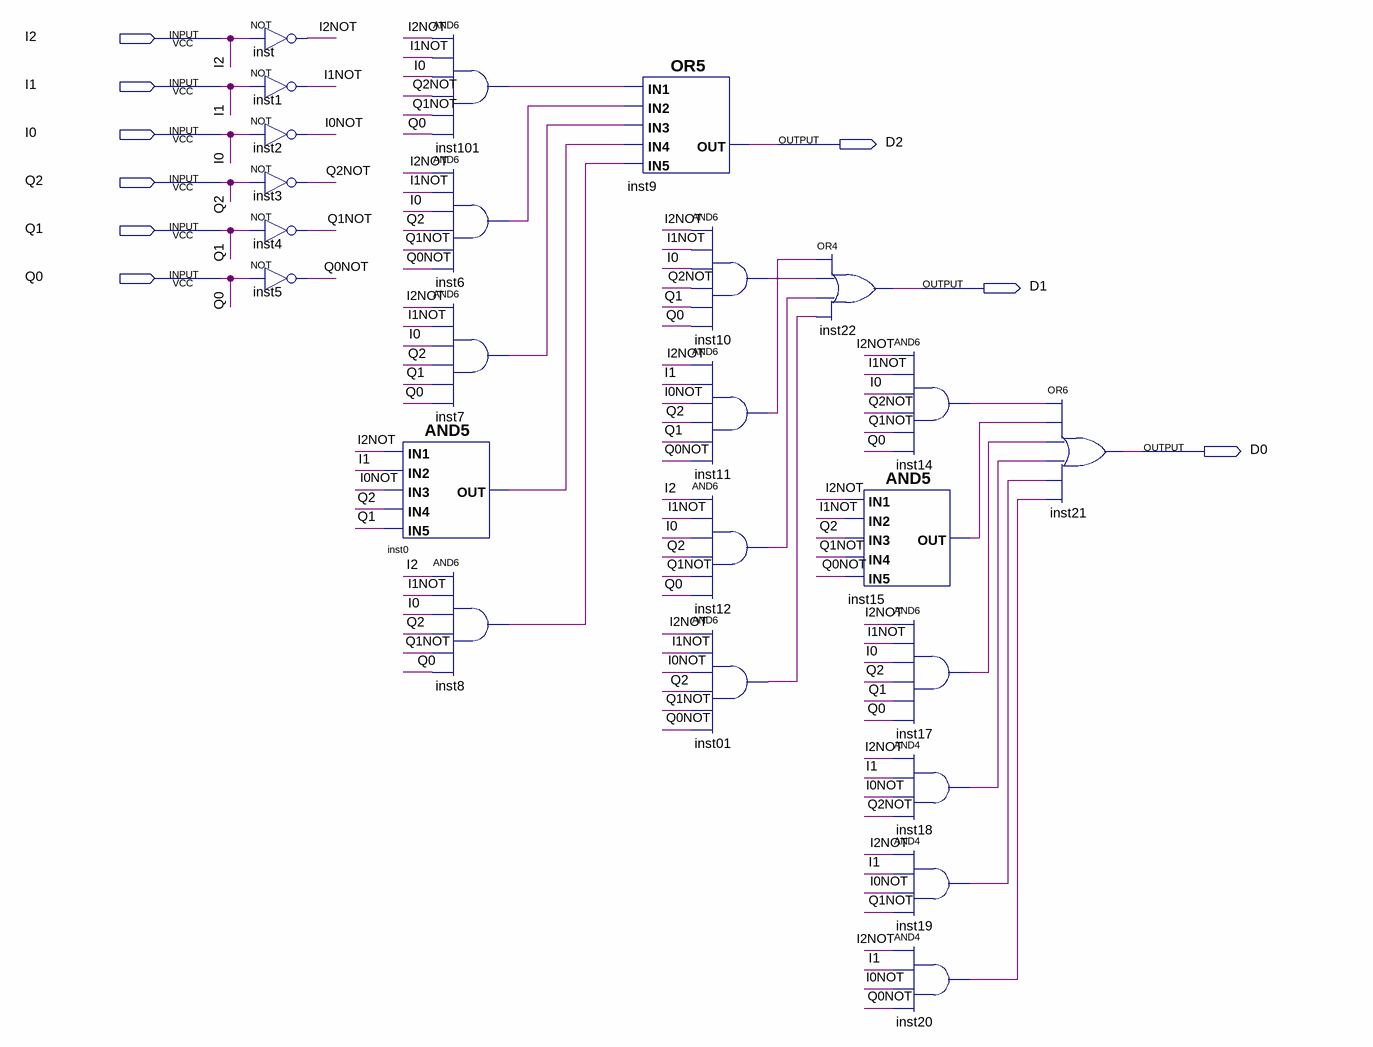
[diagram p0: schematic sheet]
// Quartus schematic NEXTSTATE.bdf as structural Verilog: 24 symbols, 9 pins
module NEXTSTATE (
  input  I2,
  input  I1,
  input  I0,
  input  Q2,
  input  Q1,
  input  Q0,
  output D2,
  output D1,
  output D0
);

  wire I0NOT, I1NOT, I2NOT, inst0_out, inst01_out, inst6_out, inst7_out, inst8_out, inst10_out, inst11_out,
       inst12_out, inst14_out, inst15_out, inst17_out, inst18_out, inst19_out, inst20_out, inst101_out,
       Q0NOT, Q1NOT, Q2NOT;

  not inst (I2NOT, I2);
  not inst1 (I1NOT, I1);
  not inst2 (I0NOT, I0);
  not inst3 (Q2NOT, Q2);
  not inst4 (Q1NOT, Q1);
  not inst5 (Q0NOT, Q0);
  and inst0 (inst0_out, I2NOT, I1, I0NOT, Q2, Q1);
  and inst101 (inst101_out, I2NOT, I1NOT, I0, Q2NOT, Q1NOT, Q0);
  and inst6 (inst6_out, I2NOT, I1NOT, I0, Q2, Q1NOT, Q0NOT);
  and inst7 (inst7_out, I2NOT, I1NOT, I0, Q2, Q1, Q0);
  and inst8 (inst8_out, I2, I1NOT, I0, Q2, Q1NOT, Q0);
  or inst9 (D2, inst101_out, inst6_out, inst7_out, inst0_out, inst8_out);
  and inst10 (inst10_out, I2NOT, I1NOT, I0, Q2NOT, Q1, Q0);
  and inst11 (inst11_out, I2NOT, I1, I0NOT, Q2, Q1, Q0NOT);
  and inst12 (inst12_out, I2, I1NOT, I0, Q2, Q1NOT, Q0);
  and inst01 (inst01_out, I2NOT, I1NOT, I0NOT, Q2, Q1NOT, Q0NOT);
  or inst22 (D1, inst11_out, inst10_out, inst12_out, inst01_out);
  and inst15 (inst15_out, I2NOT, I1NOT, Q2, Q1NOT, Q0NOT);
  and inst14 (inst14_out, I2NOT, I1NOT, I0, Q2NOT, Q1NOT, Q0);
  and inst17 (inst17_out, I2NOT, I1NOT, I0, Q2, Q1, Q0);
  and inst18 (inst18_out, I2NOT, I1, I0NOT, Q2NOT);
  and inst19 (inst19_out, I2NOT, I1, I0NOT, Q1NOT);
  and inst20 (inst20_out, I2NOT, I1, I0NOT, Q0NOT);
  or inst21 (D0, inst14_out, inst15_out, inst17_out, inst18_out, inst19_out, inst20_out);
endmodule
